# Altium schematic sheet jlink072.SchDoc
size A4
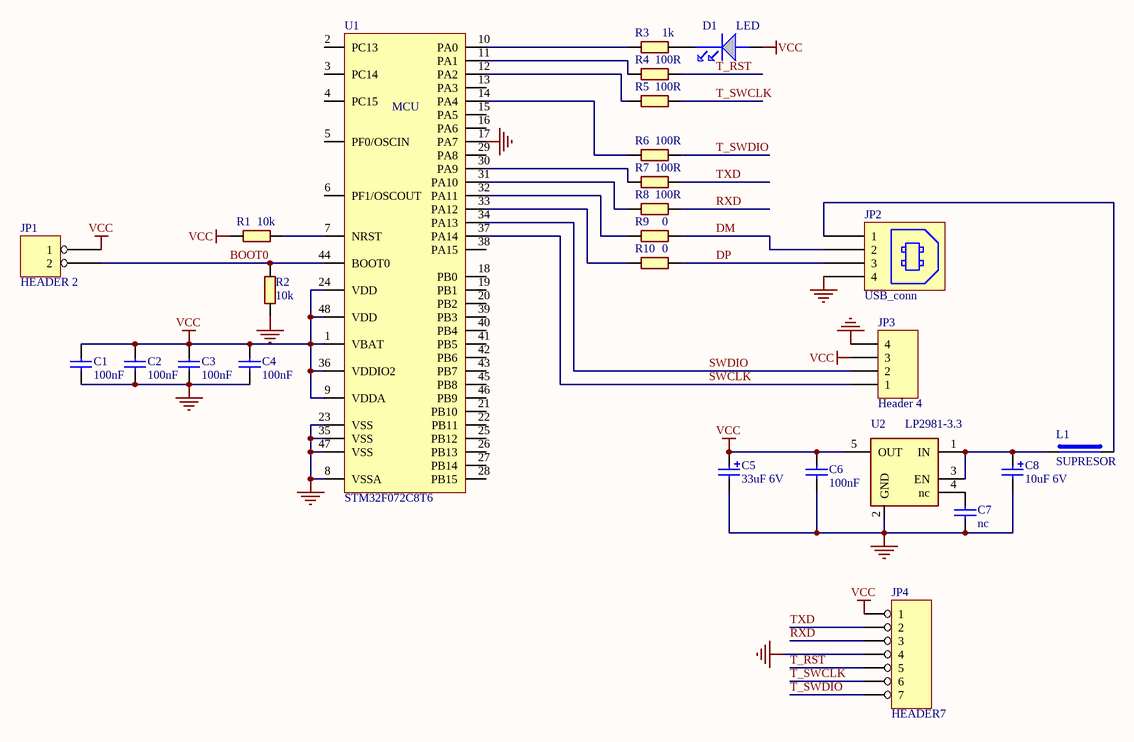
[diagram p0: jlink072.SchDoc]

## Parts
C1  100nF  [C-0603]
C2  100nF  [C-0603]
C3  100nF  [C-0603]
C4  100nF  [C-0603]
C5  33uF 6V  [TANTAL-B]
C6  100nF  [C-0603]
C7  nc  [C-0603]
C8  10uF 6V  [TANTAL-A]
D1  LED  [LED-0805]
JP1  HEADER 2  [PLS1-2]
JP2  USB_conn  [USB_A_M_SMD]
JP3  Header 4  [PLS1-4]
JP4  HEADER7  [PLS1-7]
L1  SUPRESOR  [R-1206]
R1  10k  [R-0603]
R2  10k  [R-0603]
R3  1k  [R-0603]
R4  100R  [R-0603]
R5  100R  [R-0603]
R6  100R  [R-0603]
R7  100R  [R-0603]
R8  100R  [R-0603]
R9  0  [R-0603]
R10  0  [R-0603]
U1  STM32F072C8T6  [LQFP48]
U2  LP2981-3.3  [SOT-23-5]

## Nets
GND: C1.2 C2.2 C3.2 C4.2 C5.1 C6.2 C7.2 C8.1 JP2.4 JP3.4 JP4.4 R2.1 U1.8(VSSA) U1.17(PA7) U1.23(VSS) U1.35(VSS) U1.47(VSS) U2.2(GND)
VCC: C1.1 C2.1 C3.1 C4.1 C5.2 C6.1 D1.A(ANODE) JP1.1 JP3.3 JP4.1 R1.1 U1.1(VBAT) U1.9(VDDA) U1.24(VDD) U1.36(VDDIO2) U1.48(VDD) U2.5(OUT)
BOOT0: JP1.2 R2.2 U1.44(BOOT0)
DM: JP2.2 R9.2
DP: JP2.3 R10.2
RXD: JP4.3 R8.2
SWCLK: JP3.1 U1.37(PA14)
SWDIO: JP3.2 U1.34(PA13)
T_RST: JP4.5 R4.2
T_SWCLK: JP4.6 R5.2
T_SWDIO: JP4.7 R6.2
TXD: JP4.2 R7.2
NetC7_1: C7.1 U2.4(nc)
NetC8_2: C8.2 L1.1 U2.1(IN) U2.3(EN)
NetD1_K: D1.K(CATHODE) R3.2
NetJP2_1: JP2.1 L1.2
NetR1_2: R1.2 U1.7(NRST)
NetR3_1: R3.1 U1.10(PA0)
NetR4_1: R4.1 U1.11(PA1)
NetR5_1: R5.1 U1.12(PA2)
NetR6_1: R6.1 U1.14(PA4)
NetR7_1: R7.1 U1.30(PA9)
NetR8_1: R8.1 U1.31(PA10)
NetR9_1: R9.1 U1.32(PA11)
NetR10_1: R10.1 U1.33(PA12)

Not connected (* = marked no-connect by the designer): U1 2(PC13) 3(PC14) 4(PC15) 5(PF0/OSCIN) 6(PF1/OSCOUT) 13(PA3) 15(PA5) 16(PA6) 18(PB0) 19(PB1) 20(PB2) 21(PB10) 22(PB11) 25(PB12) 26(PB13) 27(PB14) 28(PB15) 29(PA8) 38(PA15) 39(PB3) 40(PB4) 41(PB5) 42(PB6) 43(PB7) 45(PB8) 46(PB9)

## Notes on the sheet
- (in symbol STM32F072C8T6) MCU

## Library data of the parts
C1-C4 C6 C7 = CAPN: Part Field 1: Hitano; Part Field 7: 10%; Part Field 8: 50V; Part Field 9: X7R
C5 C8 = CAPP: Part Field 1: *; Part Field 7: *; Part Field 8: *; Part Field 9: *
JP1 = HEADER 2: Вид: Роз'єм; *: *
JP2 = USB_conn: USB_connector
JP3 = Header 4: Header, 4-Pin; LatestRevisionDate: 17-Jul-2002; LatestRevisionNote: Re-released for DXP Platform.; Publisher: Altium Limited
JP4 = HEADER7: Вид: Роз'єм; *: *
R1-R10 = RES: Part Field 1: UniOhm; Part Field 7: 5%
L1 = SUPRESOR: Примечание: *; Производитель: *